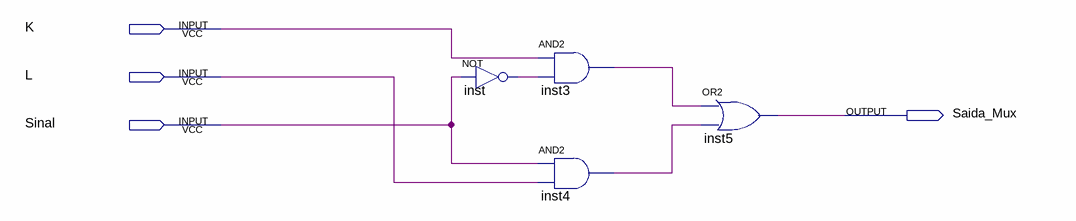
[diagram p0: schematic sheet]
// Quartus schematic MUX2-1bt.bdf as structural Verilog: 4 symbols, 4 pins
module \MUX2-1bt  (
  input  K,
  input  L,
  input  Sinal,
  output Saida_Mux
);

  wire inst3_out, inst4_out, inst_out;

  not inst (inst_out, Sinal);
  and inst3 (inst3_out, K, inst_out);
  and inst4 (inst4_out, Sinal, L);
  or inst5 (Saida_Mux, inst3_out, inst4_out);
endmodule
